# Altium project Gestura_Glove_PCB.PrjPcb
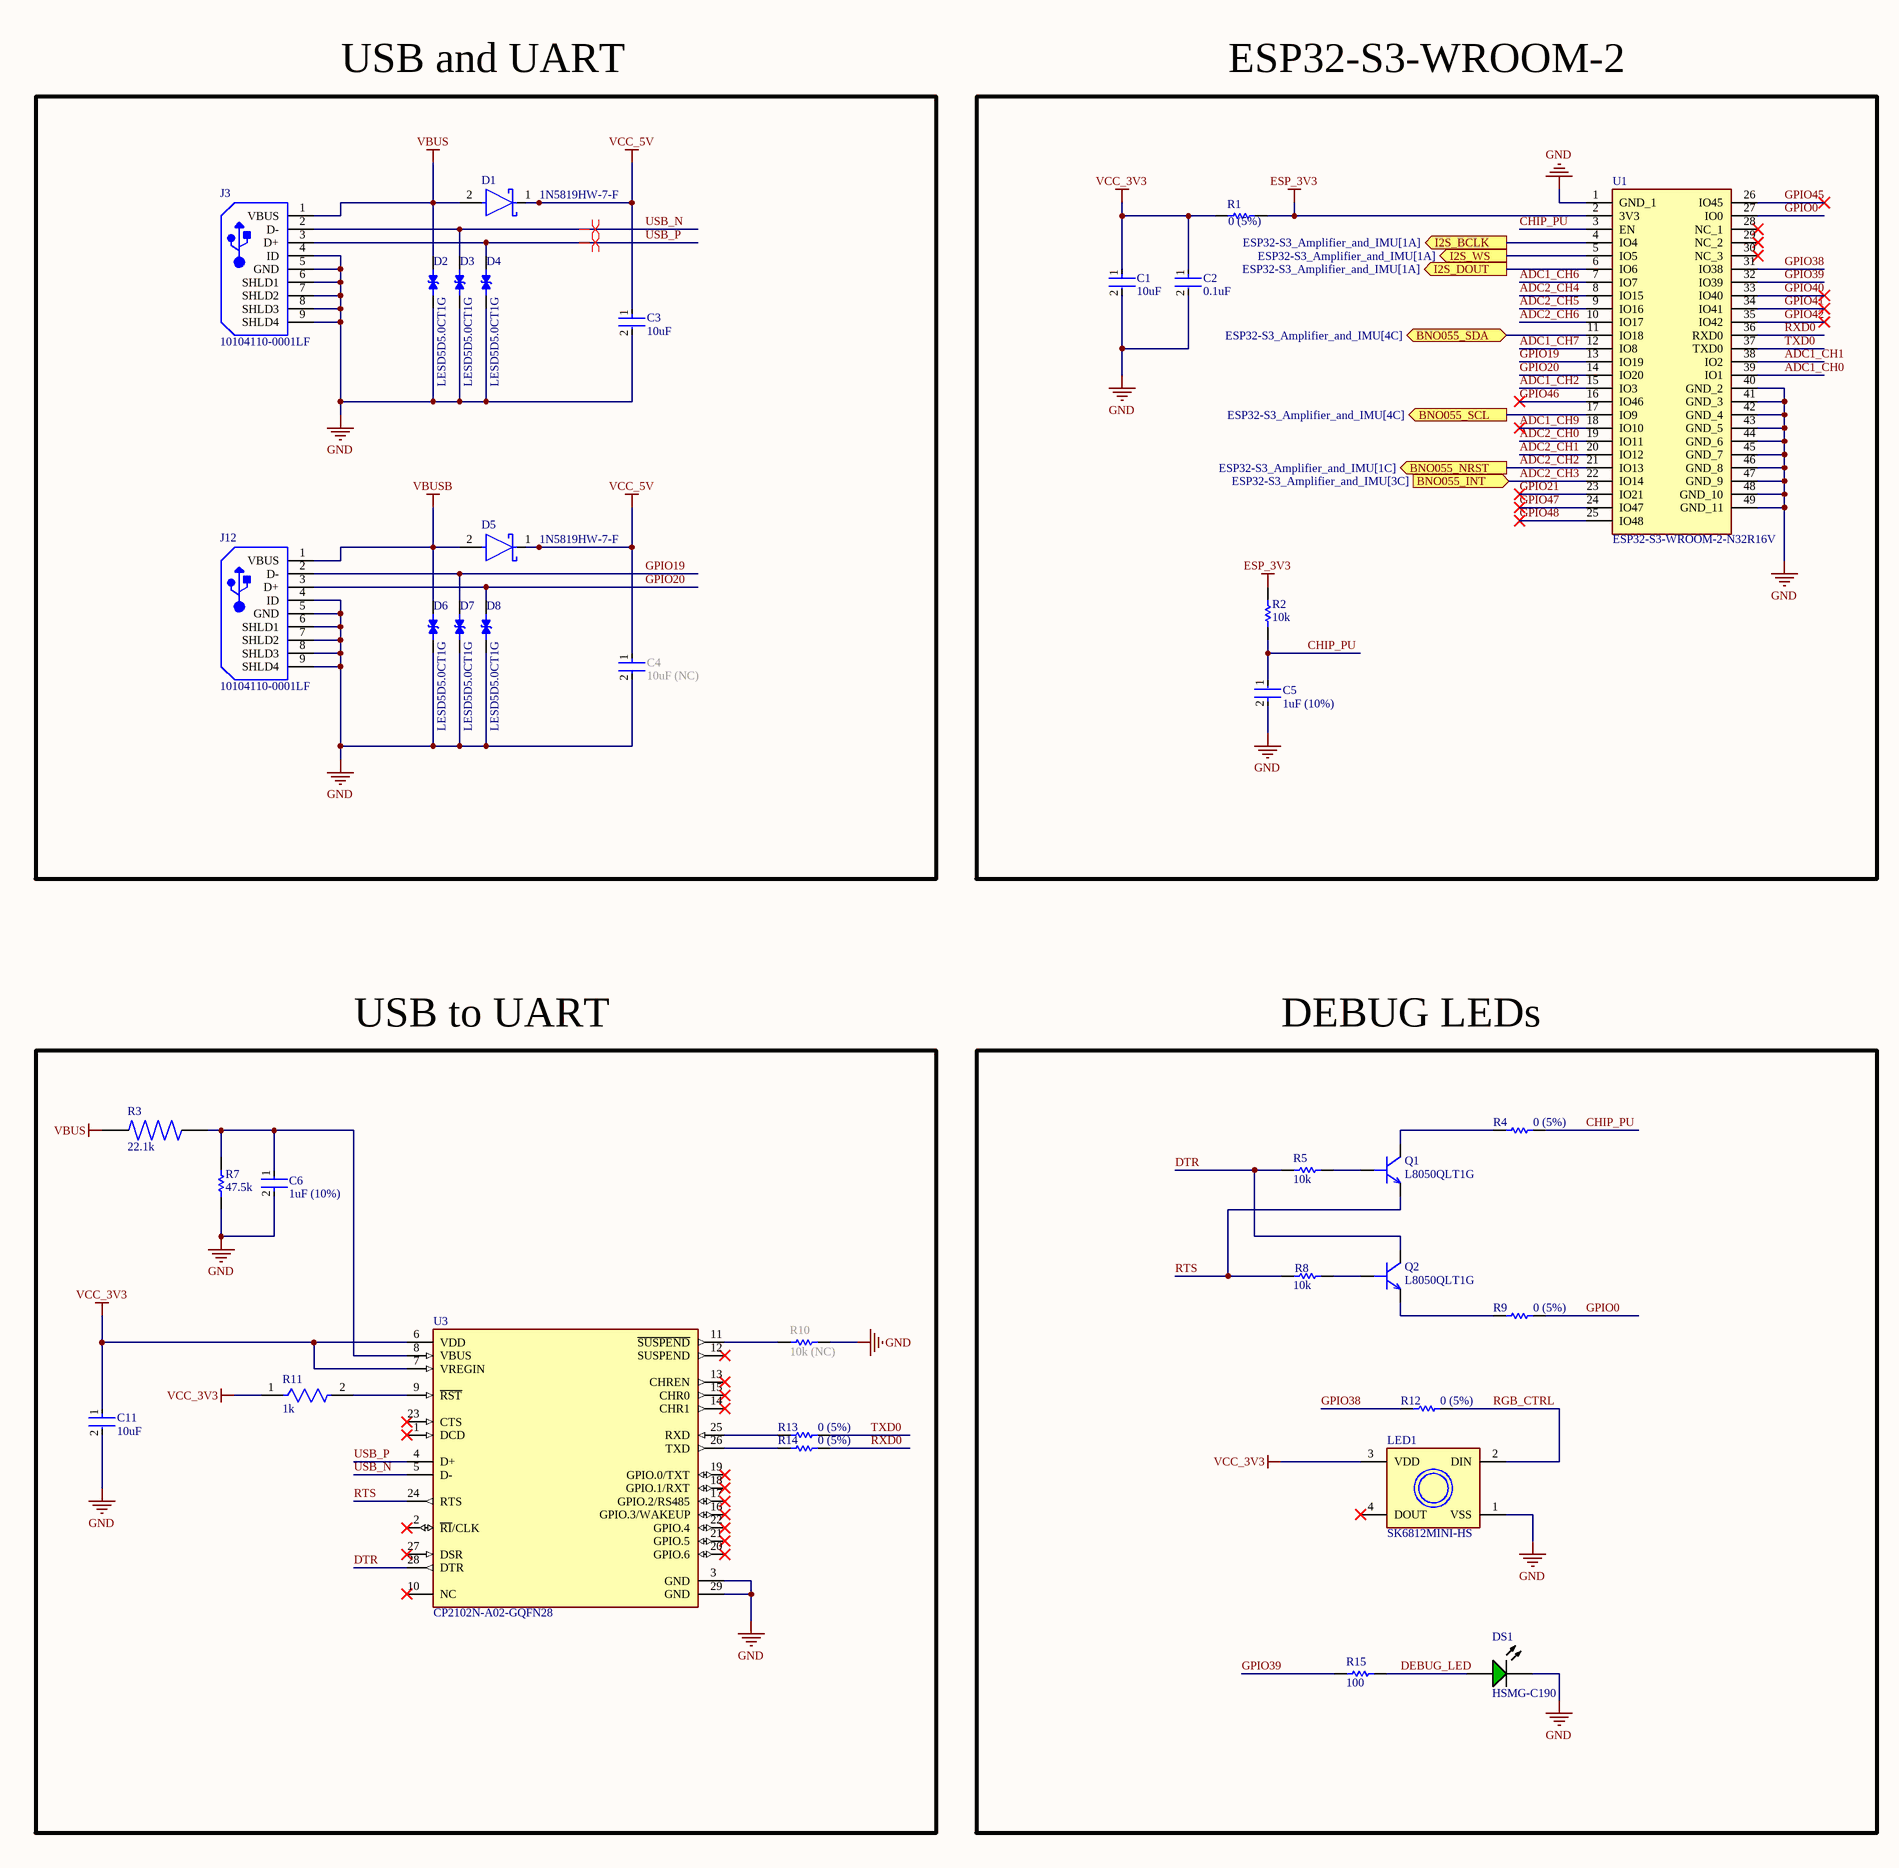
[diagram p0: ESP32-S3_Devkit_Replica.SchDoc, left]
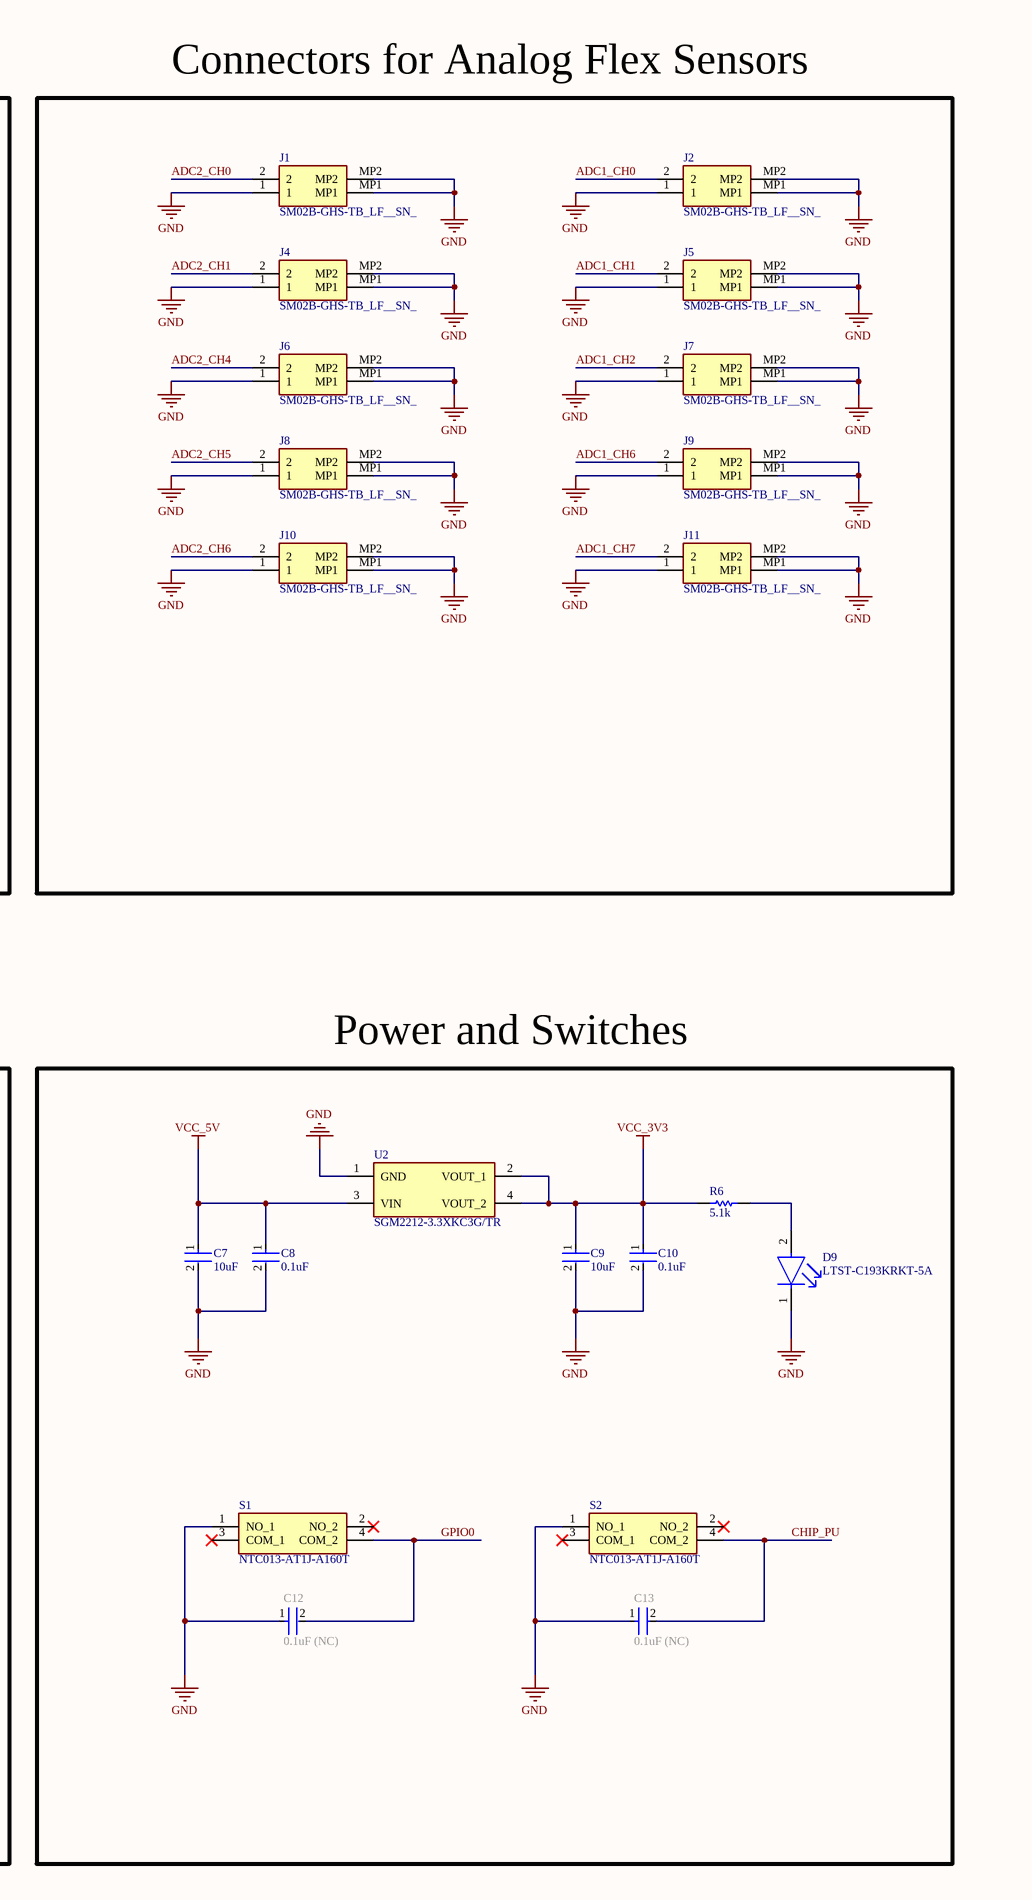
[diagram p1: ESP32-S3_Devkit_Replica.SchDoc, right]
2 sheets, 77 parts. Net scope: flat (ports and power ports of the same name join across sheets).
Board file: GesturaPCBLayout.PcbDoc
Sheets:
  ESP32-S3_Devkit_Replica.SchDoc
  ESP32-S3_Amplifier_and_IMU.SchDoc

## Sheet ESP32-S3_Devkit_Replica.SchDoc: ESP32-S3 DevKit Replica
size A2; DrawnBy: AXW; SheetNumber: 1; SheetTotal: 2

### Parts
C1  Capacitance: 10uF  [FP-GRM21B-0_2-e0_2_0_7-IPC_B]  (hidden comment: GRM21BC8YA106KE11L)
C2  Capacitance: 0.1uF  [FP-C1005-050-0_05-IPC_C]  (hidden comment: C1005X7R1H104K050BB)
C3  Capacitance: 10uF  [FP-GRM21B-0_2-e0_2_0_7-IPC_B]  (hidden comment: GRM21BC8YA106KE11L)
C4  Capacitance: 10uF (NC)  [FP-GRM21B-0_2-e0_2_0_7-IPC_B]  (hidden comment: GRM21BC8YA106KE11L)
C5  Capacitance: 1uF (10%)  [FP-C1608-080-0_1-IPC_B]  (hidden comment: C1608X5R1H105K080AB)
C6  Capacitance: 1uF (10%)  [FP-C1608-080-0_1-IPC_B]  (hidden comment: C1608X5R1H105K080AB)
C7  Capacitance: 10uF  [FP-GRM21B-0_2-e0_2_0_7-IPC_B]  (hidden comment: GRM21BC8YA106KE11L)
C8  Capacitance: 0.1uF  [FP-C1005-050-0_05-IPC_C]  (hidden comment: C1005X7R1H104K050BB)
C9  Capacitance: 10uF  [FP-GRM21B-0_2-e0_2_0_7-IPC_B]  (hidden comment: GRM21BC8YA106KE11L)
C10  Capacitance: 0.1uF  [FP-C1005-050-0_05-IPC_C]  (hidden comment: C1005X7R1H104K050BB)
C11  Capacitance: 10uF  [FP-GRM21B-0_2-e0_2_0_7-IPC_B]  (hidden comment: GRM21BC8YA106KE11L)
C12  Capacitance: 0.1uF (NC)  [FP-C1005-050-0_05-IPC_C]  (hidden comment: C1005X7R1H104K050BB)
C13  Capacitance: 0.1uF (NC)  [FP-C1005-050-0_05-IPC_C]  (hidden comment: C1005X7R1H104K050BB)
D1  1N5819HW-7-F  [FP-SOD123-IPC_A]
D2  LESD5D5.0CT1G  [TVS_LESD5D5.0CT1G]
D3  LESD5D5.0CT1G  [TVS_LESD5D5.0CT1G]
D4  LESD5D5.0CT1G  [TVS_LESD5D5.0CT1G]
D5  1N5819HW-7-F  [FP-SOD123-IPC_A]
D6  LESD5D5.0CT1G  [TVS_LESD5D5.0CT1G]
D7  LESD5D5.0CT1G  [TVS_LESD5D5.0CT1G]
D8  LESD5D5.0CT1G  [TVS_LESD5D5.0CT1G]
D9  LTST-C193KRKT-5A  [FP-LTST-C193KRKT-5A-MFG]
DS1  HSMG-C190  [AVAG-HSMX-C190_V]
J1  SM02B-GHS-TB_LF__SN_  [SM02BGHSTBLFSN]
J2  SM02B-GHS-TB_LF__SN_  [SM02BGHSTBLFSN]
J3  10104110-0001LF  [FCI-10104110-0001LF_V]
J4  SM02B-GHS-TB_LF__SN_  [SM02BGHSTBLFSN]
J5  SM02B-GHS-TB_LF__SN_  [SM02BGHSTBLFSN]
J6  SM02B-GHS-TB_LF__SN_  [SM02BGHSTBLFSN]
J7  SM02B-GHS-TB_LF__SN_  [SM02BGHSTBLFSN]
J8  SM02B-GHS-TB_LF__SN_  [SM02BGHSTBLFSN]
J9  SM02B-GHS-TB_LF__SN_  [SM02BGHSTBLFSN]
J10  SM02B-GHS-TB_LF__SN_  [SM02BGHSTBLFSN]
J11  SM02B-GHS-TB_LF__SN_  [SM02BGHSTBLFSN]
J12  10104110-0001LF  [FCI-10104110-0001LF_V]
LED1  SK6812MINI-HS  [SK6812MINI-HS]
Q1  L8050QLT1G  [L8050QLT1G]
Q2  L8050QLT1G  [L8050QLT1G]
R1  Resistance: 0 (5%)  [RESC1005X40X25LL05T05]  (hidden comment: ERJ2GE0R00X)
R2  Resistance: 10k  [RESC1005X40X25ML05T10]  (hidden comment: CRCW040210K0FKEDHP)
R3  value 22.1k  [RES_ERA2AEB2212X]  (hidden comment: ERA2AEB2212X)
R4  Resistance: 0 (5%)  [RESC1005X40X25LL05T05]  (hidden comment: ERJ2GE0R00X)
R5  Resistance: 10k  [RESC1005X40X25ML05T10]  (hidden comment: CRCW040210K0FKEDHP)
R6  Resistance: 5.1k  [RESC1005X40X25NL05T10]  (hidden comment: RC0402FR-075K1L)
R7  Resistance: 47.5k  [RESC1005X40X25LL05T05]  (hidden comment: CRCW040247K5FKTD)
R8  Resistance: 10k  [RESC1005X40X25ML05T10]  (hidden comment: CRCW040210K0FKEDHP)
R9  Resistance: 0 (5%)  [RESC1005X40X25LL05T05]  (hidden comment: ERJ2GE0R00X)
R10  Resistance: 10k (NC)  [RESC1005X40X25ML05T10]  (hidden comment: CRCW040210K0FKEDHP)
R11  Resistance: 1k  [FP-TFCR0402-IPC_A]  (hidden comment: TFCR0402-16W-C-1001BT-1K)
R12  Resistance: 0 (5%)  [RESC1005X40X25LL05T05]  (hidden comment: ERJ2GE0R00X)
R13  Resistance: 0 (5%)  [RESC1005X40X25LL05T05]  (hidden comment: ERJ2GE0R00X)
R14  Resistance: 0 (5%)  [RESC1005X40X25LL05T05]  (hidden comment: ERJ2GE0R00X)
R15  Resistance: 100  [RESC1005X40X25LL05T05]  (hidden comment: ERJ-2RKF1000X)
S1  NTC013-AT1J-A160T  [NTC013AT1JA160T]
S2  NTC013-AT1J-A160T  [NTC013AT1JA160T]
U1  ESP32-S3-WROOM-2-N32R16V  [ESP32S3WROOM2N32R16V]
U2  SGM2212-3.3XKC3G/TR  [SOT230P700X180-4N]
U3  CP2102N-A02-GQFN28  [FP-CP2102N-A02-GQFN28-MFG]

### Blocks framed on the sheet
USB and UART: C3 C4 D1-D8 J3 J12
ESP32-S3-WROOM-2: C1 C2 C5 R1 R2 U1
Connectors for Analog Flex Sensors: J1 J2 J4-J11
USB to UART: C6 C11 R3 R7 R10 R11 R13 R14 U3
DEBUG LEDs: DS1 LED1 Q1 Q2 R4 R5 R8 R9 R12 R15
Power and Switches: C7-C10 C12 C13 D9 R6 S1 S2 U2

### Ports
BNO055_INT (in, see ESP32-S3_Amplifier_and_IMU[3C]), BNO055_NRST (out, see ESP32-S3_Amplifier_and_IMU[1C]), BNO055_SCL (out, see ESP32-S3_Amplifier_and_IMU[4C]), BNO055_SDA (bidir, see ESP32-S3_Amplifier_and_IMU[4C]), I2S_BCLK (out, see ESP32-S3_Amplifier_and_IMU[1A]), I2S_DOUT (out, see ESP32-S3_Amplifier_and_IMU[1A]), I2S_WS (out, see ESP32-S3_Amplifier_and_IMU[1A])

### Nets
ESP_3V3: R1.2 R2.2 U1.2(3V3)
GND: C1.2 C2.2 C3.2 C4.2 C5.2 C6.2 C7.2 C8.2 C9.2 C10.2 C11.2 C12.1 C13.1 D2.2 D3.2 D4.2 D6.2 D7.2 D8.2 D9.1(C) DS1.2(K) J1.1 J1.MP1 J1.MP2 J2.1 J2.MP1 J2.MP2 J3.4(ID) J3.5(GND) J3.6(SHLD1) J3.7(SHLD2) J3.8(SHLD3) J3.9(SHLD4) J4.1 J4.MP1 J4.MP2 J5.1 J5.MP1 J5.MP2 J6.1 J6.MP1 J6.MP2 J7.1 J7.MP1 J7.MP2 J8.1 J8.MP1 J8.MP2 J9.1 J9.MP1 J9.MP2 J10.1 J10.MP1 J10.MP2 J11.1 J11.MP1 J11.MP2 J12.4(ID) J12.5(GND) J12.6(SHLD1) J12.7(SHLD2) J12.8(SHLD3) J12.9(SHLD4) LED1.1(VSS) R7.2 R10.2 S1.1(NO_1) S2.1(NO_1) U1.1(GND_1) U1.40(GND_2) U1.41(GND_3) U1.42(GND_4) U1.43(GND_5) U1.44(GND_6) U1.45(GND_7) U1.46(GND_8) U1.47(GND_9) U1.48(GND_10) U1.49(GND_11) U2.1(GND) U3.3(GND) U3.29(GND)
VBUS: D1.2(A) D2.1 J3.1(VBUS) R3.2
VBUSB: D5.2(A) D6.1 J12.1(VBUS)
VCC_3V3: C1.1 C2.1 C9.1 C10.1 C11.1 LED1.3(VDD) R1.1 R6.2 R11.1 U2.2(VOUT_1) U2.4(VOUT_2) U3.6(VDD) U3.7(VREGIN)
VCC_5V: C3.1 C4.1 C7.1 C8.1 D1.1(C) D5.1(C) U2.3(VIN)
ADC1_CH0: J2.2 U1.39(IO1)
ADC1_CH1: J5.2 U1.38(IO2)
ADC1_CH2: J7.2 U1.15(IO3)
ADC1_CH6: J9.2 U1.7(IO7)
ADC1_CH7: J11.2 U1.12(IO8)
ADC1_CH9: U1.18(IO10)
ADC2_CH0: J1.2 U1.19(IO11)
ADC2_CH1: J4.2 U1.20(IO12)
ADC2_CH2: U1.21(IO13) ; port BNO055_NRST
ADC2_CH3: U1.22(IO14) ; port BNO055_INT
ADC2_CH4: J6.2 U1.8(IO15)
ADC2_CH5: J8.2 U1.9(IO16)
ADC2_CH6: J10.2 U1.10(IO17)
CHIP_PU: C5.1 C13.2 R2.1 R4.2 S2.4(COM_2) U1.3(EN)
DEBUG_LED: DS1.1(A) R15.1
DTR: Q2.1(C) R5.2 U3.28(DTR)
GPIO0: C12.2 R9.2 S1.4(COM_2) U1.27(IO0)
GPIO19: D7.1 J12.2(D-) U1.13(IO19)
GPIO20: D8.1 J12.3(D+) U1.14(IO20)
GPIO21: U1.23(IO21)
GPIO38: R12.1 U1.31(IO38)
GPIO39: R15.2 U1.32(IO39)
GPIO40: U1.33(IO40)
GPIO41: U1.34(IO41)
GPIO42: U1.35(IO42)
GPIO45: U1.26(IO45)
GPIO46: U1.16(IO46)
GPIO47: U1.24(IO47)
GPIO48: U1.25(IO48)
RGB_CTRL: LED1.2(DIN) R12.2
RTS: Q1.2(E) R8.2 U3.24(RTS)
RXD0: R14.2 U1.36(RXD0)
TXD0: R13.2 U1.37(TXD0)
USB_N: D3.1 J3.2(D-) U3.5(D-)
USB_P: D4.1 J3.3(D+) U3.4(D+)
NetC6_1: C6.1 R3.1 R7.1 U3.8(VBUS)
NetD9_2: D9.2(A) R6.1
NetIC1_1: U1.6(IO6) ; port I2S_DOUT
NetIC1_14: U1.5(IO5) ; port I2S_WS
NetIC1_16: U1.4(IO4) ; port I2S_BCLK
NetQ1_1: Q1.1(C) R4.1
NetQ1_3: Q1.3(B) R5.1
NetQ2_2: Q2.2(E) R9.1
NetQ2_3: Q2.3(B) R8.1
NetR10_1: R10.1 U3.11(~{SUSPEND})
NetR11_2: R11.2 U3.9(~{RST})
NetR13_1: R13.1 U3.25(RXD)
NetR14_1: R14.1 U3.26(TXD)
NetR17_1: U1.11(IO18) ; port BNO055_SDA
NetR18_1: U1.17(IO9) ; port BNO055_SCL

Not connected (* = marked no-connect by the designer): LED1 4(DOUT)*; S1 2(NO_2)* 3(COM_1)*; S2 2(NO_2)* 3(COM_1)*; U1 28(NC_1)* 29(NC_2)* 30(NC_3)*; U3 1(DCD)* 2(~{RI}/CLK)* 10(NC)* 12(SUSPEND)* 13(CHREN)* 14(CHR1)* 15(CHR0)* 16(GPIO.3/WAKEUP)* 17(GPIO.2/RS485)* 18(GPIO.1/RXT)* 19(GPIO.0/TXT)* 20(GPIO.6)* 21(GPIO.5)* 22(GPIO.4)* 23(CTS)* 27(DSR)*

### Layout directives
differential pair: USB_N, USB_P

### Library data of the parts
C1 C3 C4 C7 C9 C11 = CMP-06035-021046-1: Chip Multilayer Ceramic Capacitors for General Purpose, 0805, 10uF, X6S, 22%, 10%, 35V; Case/Package: 0805; Case Code (Metric): 2012; Case Code (Imperial): 0805; Voltage Rating (DC): 35V; Tolerance: 10%; Thickness: 0.057inch; Dielectric: X6S; Package Quantity: 3000; Weight: 0.000335oz; Termination: SMD/SMT; Max Operating Temperature: 105°C; Voltage Rating: 35V; Packaging: Tape and Reel; Width: 1.25mm; Mount: Surface Mount; Min Operating Temperature: -55°C; Length: 0.079inch; Height: 1.25mm; REACH SVHC: No SVHC; Lead Free: Lead Free
C2 C8 C10 C12 C13 = CMP-2000-05393-2: Multilayer Ceramic Capacitors 100nF ±10% 50V X7R SMD 0402; Voltage: 50V; Dielectric Material: Ceramic; Min Operating Temperature: -55°C; Depth: 0.5mm; Radiation Hardening: No; RoHS Compliant: Yes; Voltage Rating (DC): 50V; Lead Free: Lead Free; Resistor Type: Ceramic; Height: 0.5mm; Dielectric: X7R; Thickness: 0.022inch; Case/Package: 0402; Case Code (Metric): 1005; Termination: SMD/SMT; Packaging: Tape and Reel; Max Operating Temperature: 125°C; Mount: Surface Mount; Package Quantity: 1; Width: 0.02inch; Weight: 2.3E-05oz; Voltage Rating: 50V; Tolerance: 10%; Construction: Flat; Case Code (Imperial): 0402; Length: 1mm; REACH SVHC: No SVHC; Series: C
C5 C6 = CMP-2000-06025-2: Multilayer Ceramic Capacitors 1μF ±10% 50V X5R SMD 0603; Lead Free: Lead Free; Height: 0.8mm; Mount: Surface Mount; Radiation Hardening: No; Thickness: 0.035inch; Length: 1.6mm; Max Operating Temperature: 85°C; REACH SVHC: No SVHC; Min Operating Temperature: -55°C; Construction: Flat; RoHS Compliant: Yes; Voltage Rating: 50V; Dielectric: X5R; Packaging: Tape and Reel; Termination: SMD/SMT; Voltage Rating (DC): 50V; Case Code (Imperial): 0603; Voltage: 50V; Width: 0.031inch; Weight: 7.1E-05oz; Depth: 0.8mm; Case Code (Metric): 1608; Series: C; Case/Package: 0603; Tolerance: 10%; Resistor Type: Ceramic; Number of Pins: 2; Dielectric Material: Ceramic; Package Quantity: 1
D1 D5 = CMP-0303-00003-3: DIODE SCHOTTKY 40V 1A SOD123; Forward Voltage: 450mV; Capacitance: 110pF; Max Forward Surge Current (Ifsm): 25A; Peak Reverse Current: 50uA; Polarity: Standard; Element Configuration: Single; Max Power Dissipation: 450mW; Min Operating Temperature: -65°C; Package Quantity: 3000; Contact Plating: Tin; Weight: 0.000353oz; Max Repetitive Reverse Voltage (Vrrm): 40V; Max Reverse Voltage (DC): 40V; Height: 1.25mm; Average Rectified Current: 1A; Width: 1.7mm; Case/Package: SOD-123-2; Lead Free: Lead Free; Max Operating Temperature: 125°C; Current Rating: 1A; Termination: SMD/SMT; Forward Current: 1A; Radiation Hardening: No; Number of Pins: 2; Length: 2.85mm; Voltage Rating (DC): 40V; REACH SVHC: No SVHC; Peak Non-Repetitive Surge Current: 25A; Packaging: Tape and Reel; Output Current: 1A
D2-D4 D6-D8 = LESD5D5.0CT1G: Transient Voltage Suppressors for ESD Protection; MF: Leshan Radio Co.; Check_prices: https://www.snapeda.com/parts/LESD5D5.0CT1G/Leshan+Radio+Co./view-part/?ref=eda; Value: *; Availability: Not in stock; Package: None; SnapEDA_Link: https://www.snapeda.com/parts/LESD5D5.0CT1G/Leshan+Radio+Co./view-part/?ref=snap; MP: LESD5D5.0CT1G; Price: None
D9 = CMP-2000-06623-2: LED RED CLEAR CHIP SMD; Power Dissipation: 50mW; Lens Style: Diffused; Test Current: 5mA; Dominant Wavelength: 631nm; Reverse Voltage: 5V; Number of Elements: 1; Viewing Angle: 130°; Luminous Intensity: 45mcd; Lens Color: Colorless; Forward Voltage: 2.3V; Case Code (Imperial): 0603; Illumination Color: Red; Lead Free: Lead Free; Radiation Hardening: No; Width: 0.8mm; Number of Pins: 2; Packaging: Tape and Reel; Depth: 0.8mm; Height: 0.35mm; Mount: Surface Mount; Case Code (Metric): 1608; Forward Current: 5mA; Lens Transparency: Clear; Case/Package: 0603; Length: 1.6mm; Color: Red; Max Operating Temperature: 85°C; Number of LEDs: 1; Min Operating Temperature: -55°C; Package Quantity: 3000
DS1 = CMP-1744-00002-1: Chip LED, Green, 2.2 V, -40 to 85 degC, 2-Pin SMD, RoHS, Tape and Reel; Frequency: 400 KHz; Max Supply Voltage: 5.5 V; Access Time: 3500 ns; Clock Frequency: 100 KHz; Case\Package: SOIC; Density: 32 kb; Nominal Supply Current: 2 mA; Interface: Serial; Min Supply Voltage: 1.7 V; Packaging: Tape and Reel; PackageReference: HSMX-C190; ComponentLink2URL: http://docs.avagotech.com/docs/AV02-0551EN; RoHSCompliant: true; Pins: 8; REACH SVHC: No SVHC; Max Operating Temperature: 85 degC; Width: 4 mm; Radiation Hardening: No; Package Quantity: 3000; ComponentLink3Description: Package Specification; ComponentLink1Description: Manufacturer URL; Min Operating Temperature: -40 degC; PackageDescription: 2-Pin Surface Mount Device, Body 1.6 x 0.8 mm, Height 0.9 mm; Max Clock Frequency: 100 KHz; Height: 1.5 mm; ComponentLink1URL: http://www.avagotech.com/; DatasheetVersion: Mar-12; ComponentLink2Description: Datasheet; Mount: Surface Mount; Length: 5 mm; ComponentLink3URL: http://www.fairchildsemi.com/dwg/MA/MA03D.pdf
J1 J2 J4-J11 = SM02B-GHS-TB_LF__SN_: Connector; Manufacturer_Name: JST (JAPAN SOLDERLESS TERMINALS); Manufacturer_Part_Number: SM02B-GHS-TB(LF)(SN);-; Datasheet Link: https://www.jst-mfg.com/product/pdf/eng/eGH.pdf?5f47a99109e2b; Height: 4.25mm; Mouser Part Number: 306-SM02BGHSTBLFSN; Mouser Price/Stock: https://www.mouser.co.uk/ProductDetail/JST-Commercial/SM02B-GHS-TBLFSN-?qs=QpmGXVUTftESG1q8ruD2pA%3D%3D
J3 J12 = CMP-2000-05823-1: Micro USB, Receptacle, -55 to 85 degC, 5-Pin SMD, RoHS, Tape and Reel; Manufacturer: FCI Electronics; Connector Type: USBMicroB; Contact Termination: SurfaceMountRightAngle; Connector Mounting: PCB; No. of Contacts: 5; Manufacturer URL: http://portal.fciconnect.com/; Contact Plating: Gold; Package Description: 5-Pin Surface Mount Device, Body 8.06 x 5.6 mm, Pitch 0.65 mm; Datasheet URL: http://portal.fciconnect.com/Comergent//fci/drawing/10104110.pdf; Datasheet Version: Rev. C, 03/2011; Package Reference: 10104110-0001LF; Mounting Technology: SurfaceMount; Gender: Receptacle
LED1 = SK6812MINI-HS: LED; Manufacturer_Name: Intelligent LED Solutions; Manufacturer_Part_Number: ILPH-K501-RGBW-SK6812-05-01; Datasheet Link: https://docs.rs-online.com/4a12/A700000006465151.pdf; Height: 1.7mm
Q1 Q2 = L8050QLT1G: 25V 225mW 800mA NPN SOT-23(SOT-23-3) Bipolar Transistors - BJT ROHS
R1 R4 R9 R12-R14 = CMP-2000-07451-1: Chip Resistor, 0 Ohm, 0.1 W, -55 to 155 degC, 0402 (1005 Metric), RoHS, Tape and Reel; Manufacturer: Panasonic; Voltage Rating (DC): 50V; Temperature Coefficient: 600ppm/��C; Max Power Dissipation: 100mW; Tolerance: 5%; Number of Terminations: 2; Mount: SurfaceMount; Height: 0.35mm; Packaging: TapeandReel; Contact Plating: Tin; Manufacturer URL: http://www.panasonic.com/; Composition: ThickFilm; Max Operating Temperature: 155degC; REACH SVHC: NoSVHC; Case/Package: 0402; Package Reference: 402; Depth: 0.5mm; Package Description: 2-Pin Surface Mount Device, Body 1 x 0.5 mm; Datasheet URL: https://industrial.panasonic.com/cdbs/www-data/pdf/RDA0000/AOA0000C301.pdf; RoHSCompliant: True; Case Code (Imperial): 0402; Military Standard: Not; Min Operating Temperature: -55degC; Power Rating: 100mW; Datasheet Version: 03/2015; Length: 1mm; Case Code (Metric): 1005; Termination: SMD/SMT; Mounting Technology: SurfaceMount; Voltage Rating: 50V; Width: 0.02inch; Package Quantity: 1; Lead Free: LeadFree; Radiation Hardening: No
R2 R5 R8 R10 = CMP-2002-03043-1: 1; Manufacturer: Vishay Dale; Part Number: CRCW040210K0FKEDHP
R3 = ERA2AEB2212X: Res Thin Film 0402 22.1K Ohm 0.1% 1/16W ±25ppm/°C Molded SMD Punched Paper T/R; Package: None; Price: None; MP: ERA2AEB2212X; Availability: Unavailable
R6 = CMP-2002-07753-1: Manufacturer: Yageo / Phycomp; Part Number: RC0402FR-075K1L
R7 = CMP-2002-00418-1: Manufacturer: Vishay Dale; Part Number: CRCW040247K5FKTD
R11 = CMP-250906-288381-1: RES Thin Film,  1kΩ, 0.1%, 0.063W, 50ppm/°C, 0402; RoHS Compliant: Yes
R15 = CMP-2002-00605-3: Chip Resistor, 100 Ohm, +/- 1%, 100 mW, -55 to 155 degC, 0402 (1005 Metric), RoHS, Tape and Reel; Manufacturer: Basic Passives; Power Rating: 100 mW; Voltage Rating: 50 V; Case\/Package: 0402; Width: 0.5 mm; Pins: 2; ComponentLink2Description: Datasheet; PackageReference: 0402; Height: 0.35 mm; Tolerance: 1%; DatasheetVersion: 04/2015; Case Code (Imperial): 0402; Min Operating Temperature: -55 degC; Radiation Hardening: No; Length: 1 mm; Package Quantity: 10000; PackageDescription: 2-Pin Surface Mount Device, Body 1 x 0.5 mm; Mounting Technology: Surface Mount; Case Code (Metric): 1005; Packaging: Tape and Reel; ComponentLink1URL: http://www.panasonic.com/; RoHSCompliant: true; Max Operating Temperature: 155 degC; REACH SVHC: Yes; PartNumber: ERJ-2RKF1000X; ComponentLink1Description: Manufacturer URL; ComponentLink2URL: http://industrial.panasonic.com/cdbs/www-data/pdf/RDA0000/AOA0000C86.pdf; Mount: Surface Mount
S1 S2 = NTC013-AT1J-A160T: 4-pin Switch; Manufacturer_Name: N&H Technology; Datasheet Link: https://www.nh-technology.de/T-Mec/PDF/Series_TC/NTC013.pdf; Height: 2.7mm; Manufacturer_Part_Number: NTC013-AT1J-A160T
U1 = ESP32-S3-WROOM-2-N32R16V: Bluetooth, WiFi 802.11b/g/n, Bluetooth v5.0 Transceiver Module 2.4GHz PCB Trace Surface Mount; Manufacturer_Name: Espressif Systems; Geometry.Height: 3.25mm; Mouser Part Number: 356-SP32S3WM2N32R16V; Mouser Price/Stock: https://www.mouser.co.uk/ProductDetail/Espressif-Systems/ESP32-S3-WROOM-2-N32R16V?qs=%252BHhoWzUJg4Kf%2FwmS40wg%252BQ%3D%3D; Manufacturer_Part_Number: ESP32-S3-WROOM-2-N32R16V; Datasheet Link: https://www.digikey.in/en/products/detail/espressif-systems/ESP32-S3-WROOM-2-N32R16V/25811280; Supplier 1: DigiKey; Supplier Part Number 1: 1965-ESP32-S3-WROOM-2-N32R16VDKR-ND
U2 = SGM2212-3.3XKC3G_TR: 80dB@(120Hz) 80¦ÌA fixed 800mA 1 3.3V 2.7V 3.3V 20V 450mV@(800mA) 0.4% (MAX) SOT-223-3; Manufacturer_Name: SGMICRO; Datasheet Link: http://cn.sg-micro.com/uploads/soft/20220506/1651835177.pdf; Height: 1.8mm; Manufacturer_Part_Number: SGM2212-3.3XKC3G/TR; Supplier 1: Avnet; Supplier Part Number 1: SGM2212-3.3XKC3G/TR
U3 = CMP-08093-000005-1: IC USB TO UART BRIDGE QFN28

## Sheet ESP32-S3_Amplifier_and_IMU.SchDoc
size A4; SheetNumber: 2; SheetTotal: 2
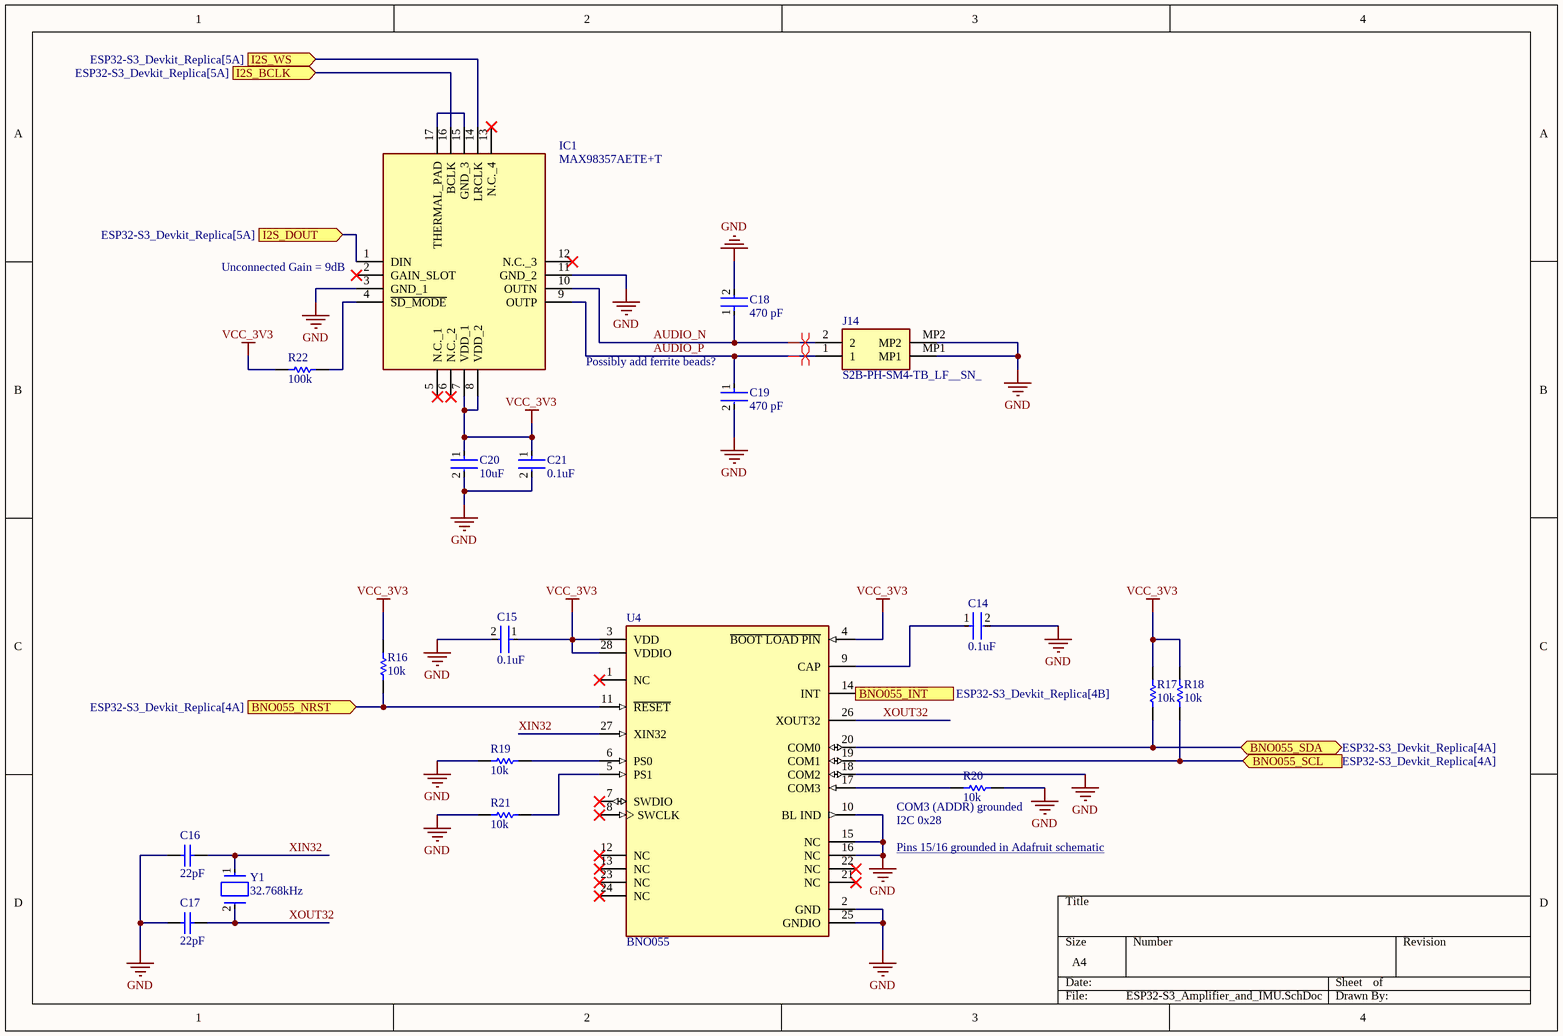
[diagram p2: ESP32-S3_Amplifier_and_IMU.SchDoc]

### Parts
C14  Capacitance: 0.1uF  [FP-C1005-050-0_05-IPC_C]  (hidden comment: C1005X7R1H104K050BB)
C15  Capacitance: 0.1uF  [FP-C1005-050-0_05-IPC_C]  (hidden comment: C1005X7R1H104K050BB)
C16  Capacitance: 22pF  [CAPC1005X55X25ML05T05]  (hidden comment: CC0402JRNPO9BN220)
C17  Capacitance: 22pF  [CAPC1005X55X25ML05T05]  (hidden comment: CC0402JRNPO9BN220)
C18  Capacitance: 470 pF  [FP-C0402-BB-MFG]  (hidden comment: C0402C471J5GACAUTO)
C19  Capacitance: 470 pF  [FP-C0402-BB-MFG]  (hidden comment: C0402C471J5GACAUTO)
C20  Capacitance: 10uF  [FP-GRM21B-0_2-e0_2_0_7-IPC_B]  (hidden comment: GRM21BC8YA106KE11L)
C21  Capacitance: 0.1uF  [FP-C1005-050-0_05-IPC_C]  (hidden comment: C1005X7R1H104K050BB)
IC1  MAX98357AETE+T  [QFN50P300X300X80-17N]
J14  S2B-PH-SM4-TB_LF__SN_  [S2BPHSM4TBLFSN]
R16  Resistance: 10k  [RESC1005X40X25ML05T10]  (hidden comment: CRCW040210K0FKEDHP)
R17  Resistance: 10k  [RESC1005X40X25ML05T10]  (hidden comment: CRCW040210K0FKEDHP)
R18  Resistance: 10k  [RESC1005X40X25ML05T10]  (hidden comment: CRCW040210K0FKEDHP)
R19  Resistance: 10k  [RESC1005X40X25ML05T10]  (hidden comment: CRCW040210K0FKEDHP)
R20  Resistance: 10k  [RESC1005X40X25ML05T10]  (hidden comment: CRCW040210K0FKEDHP)
R21  Resistance: 10k  [RESC1005X40X25ML05T10]  (hidden comment: CRCW040210K0FKEDHP)
R22  Resistance: 100k  [RESC1005X40X25NL05T10]  (hidden comment: RC0402FR-07100KL)
U4  BNO055  [FP-BNO055-MFG]
Y1  Frequency: 32.768kHz  [FP-ABS07-MFG]  (hidden comment: ABS07-32.768KHZ-T)

### Ports
BNO055_INT (out, see ESP32-S3_Devkit_Replica[4B]), BNO055_NRST (in, see ESP32-S3_Devkit_Replica[4A]), BNO055_SCL (in, see ESP32-S3_Devkit_Replica[4A]), BNO055_SDA (bidir, see ESP32-S3_Devkit_Replica[4A]), I2S_BCLK (in, see ESP32-S3_Devkit_Replica[5A]), I2S_DOUT (in, see ESP32-S3_Devkit_Replica[5A]), I2S_WS (in, see ESP32-S3_Devkit_Replica[5A])

### Nets
GND: C14.2 C15.2 C16.2 C17.2 C18.2 C19.2 C20.2 C21.2 IC1.3(GND_1) IC1.11(GND_2) J14.MP1 J14.MP2 R19.1 R20.2 R21.1 U4.2(GND) U4.10(BL_IND) U4.15(NC) U4.16(NC) U4.18(COM2) U4.25(GNDIO)
VCC_3V3: C15.1 C20.1 C21.1 IC1.7(VDD_1) IC1.8(VDD_2) R16.2 R17.2 R18.2 R22.2 U4.3(VDD) U4.4(~{BOOT_LOAD_PIN}) U4.28(VDDIO)
ADC2_CH2: R16.1 U4.11(~{RESET}) ; port BNO055_NRST
ADC2_CH3: U4.14(INT) ; port BNO055_INT
AUDIO_N: C18.1 IC1.10(OUTN) J14.2
AUDIO_P: C19.1 IC1.9(OUTP) J14.1
XIN32: C16.1 U4.27(XIN32) Y1.1
XOUT32: C17.1 U4.26(XOUT32) Y1.2
NetC14_1: C14.1 U4.9(CAP)
NetIC1_1: IC1.1(DIN) ; port I2S_DOUT
NetIC1_4: IC1.4(~{SD_MODE}) R22.1
NetIC1_14: IC1.14(LRCLK) ; port I2S_WS
NetIC1_15: IC1.15(GND_3) IC1.17(THERMAL_PAD)
NetIC1_16: IC1.16(BCLK) ; port I2S_BCLK
NetR17_1: R17.1 U4.20(COM0) ; port BNO055_SDA
NetR18_1: R18.1 U4.19(COM1) ; port BNO055_SCL
NetR19_2: R19.2 U4.6(PS0)
NetR20_1: R20.1 U4.17(COM3)
NetR21_2: R21.2 U4.5(PS1)

Not connected (* = marked no-connect by the designer): IC1 2(GAIN_SLOT)* 5(N.C._1)* 6(N.C._2)* 12(N.C._3)* 13(N.C._4)*; U4 1(NC)* 7(SWDIO)* 8(SWCLK)* 12(NC)* 13(NC)* 21(NC)* 22(NC)* 23(NC)* 24(NC)*

### Layout directives
differential pair: AUDIO_N, AUDIO_P

### Notes on the sheet
- (near IC1) Unconnected Gain = 9dB
- (near C19) Possibly add ferrite beads?
- Pins 15/16 grounded in Adafruit schematic <https://cdn-learn.adafruit.com/assets/assets/000/024/546/original/sensors_BNO055_REV-C.png>
- (near R20) COM3 (ADDR) grounded
- (near R20) I2C 0x28

### Library data of the parts
C14 C15 C21 = CMP-2000-05393-2: as C2 on sheet ESP32-S3_Devkit_Replica; Voltage: 50V; Dielectric Material: Ceramic; Min Operating Temperature: -55°C; Depth: 0.5mm; Radiation Hardening: No; RoHS Compliant: Yes; Voltage Rating (DC): 50V; Lead Free: Lead Free; Resistor Type: Ceramic; Height: 0.5mm; Dielectric: X7R; Thickness: 0.022inch; Case/Package: 0402; Case Code (Metric): 1005; Termination: SMD/SMT; Packaging: Tape and Reel; Max Operating Temperature: 125°C; Mount: Surface Mount; Package Quantity: 1; Width: 0.02inch; Weight: 2.3E-05oz; Voltage Rating: 50V; Tolerance: 10%; Construction: Flat; Case Code (Imperial): 0402; Length: 1mm; REACH SVHC: No SVHC; Series: C
C16 C17 = CMP-2100-03590-1: Chip Capacitor, 22 pF, +/- 5%, 50 V, -55 to 125 degC, 0402 (1005 Metric), RoHS, Tape and Reel; Manufacturer: Yageo; Voltage Rating: 50V; Dielectric Material: Ceramic; Temperature Coefficient: 30ppm/degC; Dielectric: C0G; Insulation Resistance: 100GR; Datasheet URL: http://www.yageo.com/NewPortal/yageodocoutput?fileName=/pdf/MLCC/UPY-GP_NP0_16V-to-50V_14.pdf; Depth: 0.5mm; Number of Pins: 2; Height: 0.5mm; Min Operating Temperature: -55degC; REACH SVHC: NoSVHC; Max Operating Temperature: 125degC; Voltage Rating (DC): 50V; Composition: Ceramic; Packaging: TapeandReel; Package Quantity: 1; Package Reference: 0402; Length: 1mm; Radiation Hardening: No; Package Description: 2-Pin Surface Mount Device, Body 1 x 0.5 mm; RoHSCompliant: True; Thickness: 0.022inch; Manufacturer URL: http://www.yageo.com/; Mount: SurfaceMount; Case Code (Metric): 1005; Case/Package: 0402; Tolerance: 5%; Termination: SMD/SMT; Width: 0.02inch; Datasheet Version: Rev. 14, 07/2016; Lead Free: LeadFree; Case Code (Imperial): 0402
C18 C19 = CMP-03020-004540-2: CAP CER 470PF 50V C0G/NP0 0402; Manufacturer: Kemet; Material: Ceramic; Tolerance: 0.05; Temperature Coefficient: 15%; Temperature Characteristic: C0G; Ipc Land Pattern Name: CAPC10050X50; Package: C0402-BB; Temperature Range Low: -55°C; ComponentLink2URL: https://content.kemet.com/datasheets/KEM_C1002_X7R_SMD.pdf; Category: Cap; Lead Free: Yes; Voltage Rating: 50 V; Automotive: No; Device Class L1: Passive Components; Temperature Range High: +125°C; Manufacturer Part Number: C0402C471J5GACAUTO; ComponentLink2Description: Datasheet; Device Class L3: Ceramic Capacitors; RoHS: TRUE; Height: 0.55mm; Octopart: https://octopart.com/c0402c471j5gacauto-kemet-34993933; Value: 470 pF; Device Class L2: Capacitors; Temperature: -55°C to +125°C; Digikey Description: CAP CER 470PF 50V C0G/NP0 0402
C20 = CMP-06035-021046-1: as C1 on sheet ESP32-S3_Devkit_Replica; Case/Package: 0805; Case Code (Metric): 2012; Case Code (Imperial): 0805; Voltage Rating (DC): 35V; Tolerance: 10%; Thickness: 0.057inch; Dielectric: X6S; Package Quantity: 3000; Weight: 0.000335oz; Termination: SMD/SMT; Max Operating Temperature: 105°C; Voltage Rating: 35V; Packaging: Tape and Reel; Width: 1.25mm; Mount: Surface Mount; Min Operating Temperature: -55°C; Length: 0.079inch; Height: 1.25mm; REACH SVHC: No SVHC; Lead Free: Lead Free
IC1 = MAX98357AETE+T: Integrated Circuit; Manufacturer_Name: Analog Devices; Datasheet Link: https://datasheets.maximintegrated.com/en/ds/MAX98357A-MAX98357B.pdf; Height: 0.8mm; Manufacturer_Part_Number: MAX98357AETE+T; Mouser Part Number: 700-MAX98357AETE+T; Mouser Price/Stock: https://www.mouser.co.uk/ProductDetail/Analog-Devices-Maxim-Integrated/MAX98357AETE%2bT?qs=AAveGqk956HhNpoJjF5x2g%3D%3D; Arrow Part Number: MAX98357AETE+T; Arrow Price/Stock: https://www.arrow.com/en/products/max98357aetet/analog-devices.html?utm_currency=USD&region=asia
J14 = S2B-PH-SM4-TB_LF__SN_: Connector; Manufacturer_Name: JST (JAPAN SOLDERLESS TERMINALS); Manufacturer_Part_Number: S2B-PH-SM4-TB(LF)(SN); Datasheet Link: https://www.jst-mfg.com/product/pdf/eng/ePH.pdf; Height: 6.6mm; Mouser Part Number: N/A; Mouser Price/Stock: https://www.mouser.co.uk/ProductDetail/JST-Commercial/S2B-PH-SM4-TBLFSN?qs=QpmGXVUTftEA9IU90i0xlg%3D%3D; Arrow Part Number: S2B-PH-SM4-TB(LF)(SN); Arrow Price/Stock: https://www.arrow.com/en/products/s2b-ph-sm4-tb-lf-sn/jst-manufacturing?utm_currency=USD&region=europe
R16-R21 = CMP-2002-03043-1: 1; Manufacturer: Vishay Dale; Part Number: CRCW040210K0FKEDHP
R22 = CMP-2002-07343-1: Manufacturer: Yageo / Phycomp; Part Number: RC0402FR-07100KL
U4 = CMP-2000-05075-4: IMU ACCEL/GYRO/MAG I2C 28LGA; Sensor Type: Accelerometer; Packaging: Tape and Reel; Case/Package: LGA; Min Operating Temperature: -40°C; Mount: Surface Mount; Output Type: I2C; Lead Free: Lead Free; Max Operating Temperature: 85°C
Y1 = CMP-0447-00001-4: Crystal 32.768kHz ±20ppm (Tol) 12.5pF FUND 70kΩ 2-Pin CSMD T/R; ESR (Equivalent Series Resistance): 70kR; Radiation Hardening: No; Length: 3.2mm; Max Operating Temperature: 85°C; Number of Pins: 2; Series: ABS07; Min Operating Temperature: -40°C; Frequency Tolerance: 20ppm; Packaging: Tape and Reel; Height: 0.9mm; Width: 1.5mm; Depth: 1.5mm; Load Capacitance: 12.5pF; RoHS Compliant: Yes; Tolerance: 20ppm; Termination: SMD/SMT; Lead Free: Lead Free; Series Resistance: 70kR; REACH SVHC: No SVHC; Case/Package: CSMD; Operating Frequency: 32.768 kHz; Package Quantity: 3000

## Nets that join several sheets
GND: ESP32-S3_Devkit_Replica (82 pins), ESP32-S3_Amplifier_and_IMU (21 pins)
VCC_3V3: ESP32-S3_Devkit_Replica (13 pins), ESP32-S3_Amplifier_and_IMU (12 pins)
ADC2_CH2: ESP32-S3_Devkit_Replica (U1.21), ESP32-S3_Amplifier_and_IMU (R16.1 U4.11)
ADC2_CH3: ESP32-S3_Devkit_Replica (U1.22), ESP32-S3_Amplifier_and_IMU (U4.14)
NetIC1_1: ESP32-S3_Devkit_Replica (U1.6), ESP32-S3_Amplifier_and_IMU (IC1.1)
NetIC1_14: ESP32-S3_Devkit_Replica (U1.5), ESP32-S3_Amplifier_and_IMU (IC1.14)
NetIC1_16: ESP32-S3_Devkit_Replica (U1.4), ESP32-S3_Amplifier_and_IMU (IC1.16)
NetR17_1: ESP32-S3_Devkit_Replica (U1.11), ESP32-S3_Amplifier_and_IMU (R17.1 U4.20)
NetR18_1: ESP32-S3_Devkit_Replica (U1.17), ESP32-S3_Amplifier_and_IMU (R18.1 U4.19)

## Assembly variants
Gestura_Glove_PCB DNP Variant: not fitted C4 C12 C13 R10